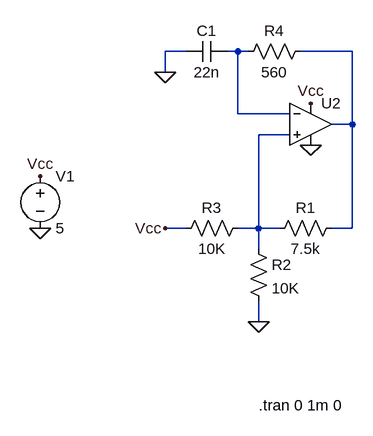
[diagram p0: schematic relax_osc.asc]
relax_osc.asc, the LTspice schematic file:
Version 4
SHEET 1 880 680
WIRE 160 112 128 112
WIRE 240 112 224 112
WIRE 256 112 240 112
WIRE 416 112 336 112
WIRE 128 144 128 112
WIRE 240 208 240 112
WIRE 320 208 240 208
WIRE 416 224 416 112
WIRE 416 224 384 224
WIRE 320 240 272 240
WIRE 160 384 128 384
WIRE 272 384 272 240
WIRE 272 384 240 384
WIRE 304 384 272 384
WIRE 416 384 416 224
WIRE 416 384 384 384
WIRE 272 416 272 384
WIRE 272 528 272 496
FLAG 272 528 0
FLAG -64 384 0
FLAG -64 304 Vcc
FLAG 352 192 Vcc
FLAG 352 256 0
FLAG 128 144 0
FLAG 128 384 Vcc
SYMBOL res 256 400 R0
SYMATTR InstName R2
SYMATTR Value 10K
SYMBOL res 256 368 R90
WINDOW 0 0 56 VBottom 2
WINDOW 3 32 56 VTop 2
SYMATTR InstName R3
SYMATTR Value 10K
SYMBOL res 400 368 R90
WINDOW 0 0 56 VBottom 2
WINDOW 3 32 56 VTop 2
SYMATTR InstName R1
SYMATTR Value 7.5k
SYMBOL voltage -64 288 R0
SYMATTR InstName V1
SYMATTR Value 5
SYMBOL res 352 96 R90
WINDOW 0 0 56 VBottom 2
WINDOW 3 32 56 VTop 2
SYMATTR InstName R4
SYMATTR Value 560
SYMBOL cap 224 96 R90
WINDOW 0 0 32 VBottom 2
WINDOW 3 32 32 VTop 2
SYMATTR InstName C1
SYMATTR Value 22n
SYMBOL OpAmps\\UniversalOpAmp2 352 224 R0
SYMATTR InstName U2
TEXT 272 656 Left 2 !.tran 0 1m 0

The netlist it stands for:
* relax_osc.asc
R2 N003 0 10K
R3 N003 Vcc 10K
R1 N002 N003 7.5k
V1 Vcc 0 5
R4 N002 N001 560
C1 N001 0 22n
XU2 N003 N001 Vcc 0 N002 level2 Avol=1Meg GBW=10Meg Slew=10Meg Ilimit=25m Rail=0 Vos=0 En=0 Enk=0 In=0 Ink=0 Rin=500Meg  ; pins In+ In- V+ V- OUT
.tran 0 1m 0
.lib UniversalOpAmp2.lib
.backanno
.end